# Altium project Brakelight_V2.PrjPcb
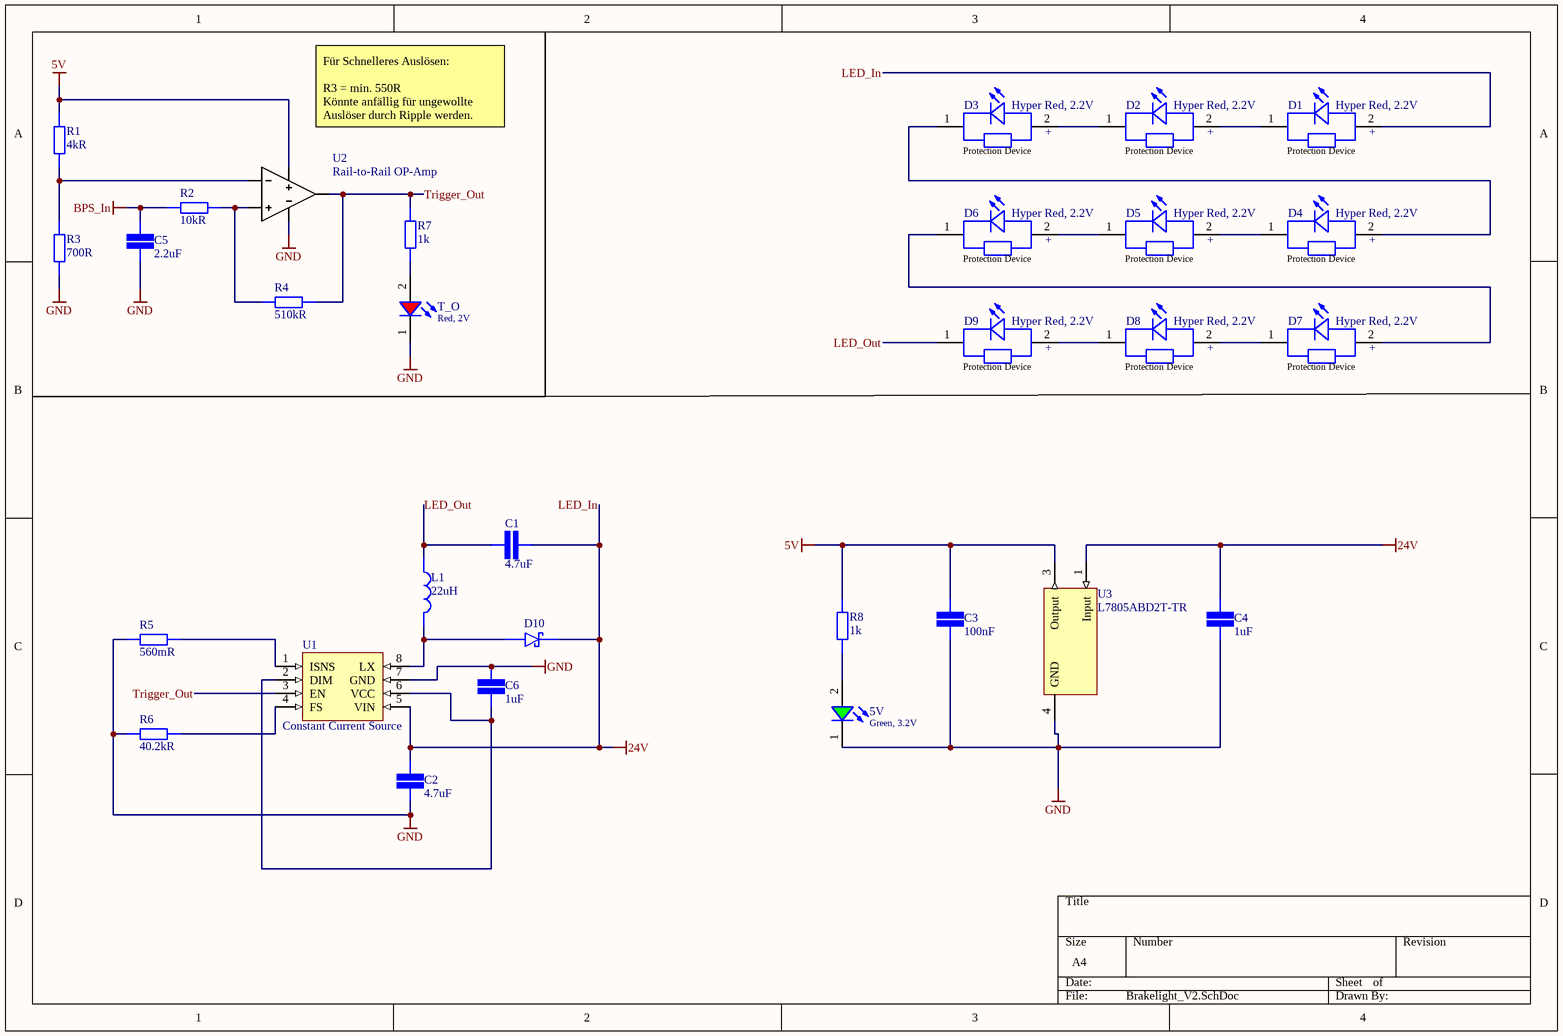
[diagram p0: Brakelight_V2.SchDoc]
1 sheet, 30 parts. Net scope: global (net labels, ports and power ports of the same name join across sheets).
Board file: Brakelight_V2.PcbDoc

## Sheet Brakelight_V2.SchDoc
size A4

### Parts
5V  Green, 3.2V  [WL-SMCW_0603_H=0.7mm]
C1  value 4.7uF  [CAP 1206/3216]  (hidden comment: SMD Capacitor 50V)
C2  value 4.7uF  [CAP 1206/3216]  (hidden comment: SMD Capacitor 50V)
C3  value 100nF  [CAP 0603/1608]  (hidden comment: SMD Capacitor 6.3V)
C4  value 1uF  [CAP 0603/1608]  (hidden comment: SMD Capacitor 25V)
C5  value 2.2uF  [CAP 0603/1608]  (hidden comment: SMD Capacitor 6.3V)
C6  value 1uF  [CAP 0603/1608]  (hidden comment: SMD Capacitor 10V)
D1  Hyper Red, 2.2V  [WL-SMDC_3535]
D2  Hyper Red, 2.2V  [WL-SMDC_3535]
D3  Hyper Red, 2.2V  [WL-SMDC_3535]
D4  Hyper Red, 2.2V  [WL-SMDC_3535]
D5  Hyper Red, 2.2V  [WL-SMDC_3535]
D6  Hyper Red, 2.2V  [WL-SMDC_3535]
D7  Hyper Red, 2.2V  [WL-SMDC_3535]
D8  Hyper Red, 2.2V  [WL-SMDC_3535]
D9  Hyper Red, 2.2V  [WL-SMDC_3535]
D10  Shottky Diode  [SODFL127P600-8N]  (value not drawn)
L1  value 22uH  [CHIP_1210_3225]  (hidden comment: SMD Inductor)
R1  value 4kR  [STACKPOLE CSR0603]  (hidden comment: SMD Resistor)
R2  value 10kR  [STACKPOLE CSR0603]  (hidden comment: SMD Resistor)
R3  value 700R  [STACKPOLE CSR0603]  (hidden comment: SMD Resistor)
R4  value 510kR  [STACKPOLE CSR0603]  (hidden comment: SMD Resistor)
R5  value 560mR  [STACKPOLE CSR0805]  (hidden comment: SMD Resistor 1/4W)
R6  value 40.2kR  [STACKPOLE CSR0603]  (hidden comment: SMD Resistor)
R7  value 1k  [STACKPOLE CSR0603]  (hidden comment: SMD Resistor)
R8  value 1k  [STACKPOLE CSR0603]  (hidden comment: SMD Resistor)
T_O  Red, 2V  [WL-SMCW_0603_H=0.7mm]
U1  Constant Current Source  [TSOP65P490X110_HS-9M]
U2  Rail-to-Rail OP-Amp  [5-Lead_SOT_SC-70]
U3  L7805ABD2T-TR  [DPAK254P1542X460-3M]

### Nets
5V: C3.1 R1.2 R8.2 U2.5(VDD) U3.3(Output)
BPS_In: C5.2 R2.2
GND: 5V.1(K) C2.1 C3.2 C4.2 C5.1 C6.2 R3.1 R5.2 R6.2 T_O.1(K) U1.7(GND) U2.2(VSS) U3.4(GND)
LED_In: C1.1 C2.2 C4.1 D1.2(A) D10.1C(C) U1.5(VIN) U3.1(Input)  [also labelled 24V]
LED_Out: C1.2 D9.1(K) L1.1
Trigger_Out: R4.1 R7.1 U1.3(EN) U2.4(Vout)
Net5V_2: 5V.2(A) R8.1
NetC6_1: C6.1 U1.2(DIM) U1.6(VCC)
NetD1_1: D1.1(K) D2.2(A)
NetD2_1: D2.1(K) D3.2(A)
NetD3_1: D3.1(K) D4.2(A)
NetD4_1: D4.1(K) D5.2(A)
NetD5_1: D5.1(K) D6.2(A)
NetD6_1: D6.1(K) D7.2(A)
NetD7_1: D7.1(K) D8.2(A)
NetD8_1: D8.1(K) D9.2(A)
NetD10_2A: D10.2A(A) L1.2 U1.8(LX)
NetR1_1: R1.1 R3.2 U2.3(Vin-)
NetR2_1: R2.1 R4.2 U2.1(Vin+)
NetR5_1: R5.1 U1.1(ISNS)
NetR6_1: R6.1 U1.4(FS)
NetR7_2: R7.2 T_O.2(A)

### Notes on the sheet
- Für Schnelleres Auslösen:
  R3 = min. 550R
  Könnte anfällig für ungewollte Auslöser durch Ripple werden.
- (in symbol 150353HS74500) +; Protection Device

### Library data of the parts
5V = 150060GS75000: WL-SMCW SMT Mono-color Chip LED Waterclear, size 0603, Green, 3.2V, 140deg; Chip Technology: InGaN; Dominant Wavelength typ.: 525nm; Luminous Intensity typ.: 430mcd; Peak Wavelength typ.: 515nm; Viewing Angle: 140deg; ComponentLink1Description: Manufacturer; ComponentLink1URL: http://www.we-online.de; ComponentLink2URL: https://www.we-online.com/catalog/datasheet/150060GS75000.pdf; ComponentLink2Description: Datasheet; Forward Voltage typ.: 3.2V; Emitting Color: Green; Mounting Technology: SMT; Operating Temperature: -40 to +85degC; Published Date: December 2019; Part Number: 150060GS75000; Packaging: Tape and Reel; Size: 0603; Publisher: Wurth Elektronik
C1 C2 C4-C6 = SMD Capacitor: Capacitor with multiple Footprints
  C1 C2: Voltage: 50V
  C4: Voltage: 25V
  C5: Voltage: 6.3V
C3 = SMD Capacitor: Capacitor with multiple Footprints; Voltage: 16V
D1-D9 = 150353HS74500: WL-SMDC Horticulture SMT Monocolor Ceramic LED Waterclear, size 3535, 2.2V, Hyper Red; Manufacturer: Wurth Elektronik; Peak Wavelength: 660nm; Viewing Angle: 125deg; Chip Technology: AlInGaP; ComponentLink1Description: Manufacturer; ComponentLink1URL: http://www.we-online.de; ComponentLink2Description: Datasheet; ComponentLink2URL: https://katalog.we-online.de/led/datasheet/150353HS74500.pdf; Operating Temperature: -40 to +100degC; Emitting Color: Hyper Red; Forward Voltage: 2.2V; Manufacturer Part Number: 150353HS74500; Packaging: Tape and Reel; Mounting Technology: SMT; Published Date: August 2020; Size: 3535
D10 = SS1FL4HM3/H: Surface-Mount Schottky Barrier Rectifier / 40V, 1A; ComponentLink1Description: Octopart; ComponentLink1URL: https://octopart.com/ss1fl4hm3%2Fh-vishay-73870157?r=sp
L1 = L1210R220MDWIT: Ind Chip High Current Unshielded Wirewound 22uH 20% 100kHz Ferrite 780mA 1210 T/R; ComponentLink1Description: Octopart; ComponentLink1URL: https://octopart.com/l1210r220mdwit-kemet-8043287?r=sp
R1-R4 R6-R8 = SMD Resistor: Resistor with multiple footprints
R5 = SMD Resistor: Resistor with multiple footprints; Power: 0.25
T_O = 150060RS75000: WL-SMCW SMT Mono-color Chip LED Waterclear, size 0603, Red, 2V, 140deg; Chip Technology: AlInGaP; Dominant Wavelength typ.: 625nm; Luminous Intensity typ.: 250mcd; Peak Wavelength typ.: 630nm; Viewing Angle: 140deg; ComponentLink1Description: Manufacturer; ComponentLink1URL: http://www.we-online.de; ComponentLink2URL: https://www.we-online.com/catalog/datasheet/150060RS75000.pdf; ComponentLink2Description: Datasheet; Forward Voltage typ.: 2V; Emitting Color: Red; Mounting Technology: SMT; Operating Temperature: -40 to +85degC; Published Date: December 2019; Part Number: 150060RS75000; Packaging: Tape and Reel; Size: 0603; Publisher: Wurth Elektronik
U1 = LM3407MYX/NOPB: LM3407 350-mA, Constant Current Output Floating Buck Switching Converter / for High-Power LEDs; ComponentLink1Description: Octopart; ComponentLink1URL: https://octopart.com/lm3407myx%2Fnopb-texas+instruments-24846104?r=sp
U2 = MCP6231UT-E/LT: MCP6231 Series 6 V 300 kHz Rail-to-Rail I/O Operational Amplifier - SC-70-5; ComponentLink1Description: Octopart; ComponentLink1URL: https://octopart.com/mcp6231ut-e%2Flt-microchip-419329?r=sp
U3 = L7805ABD2T-TR: Linear Voltage Regulators 5.0V 1.5A Positive